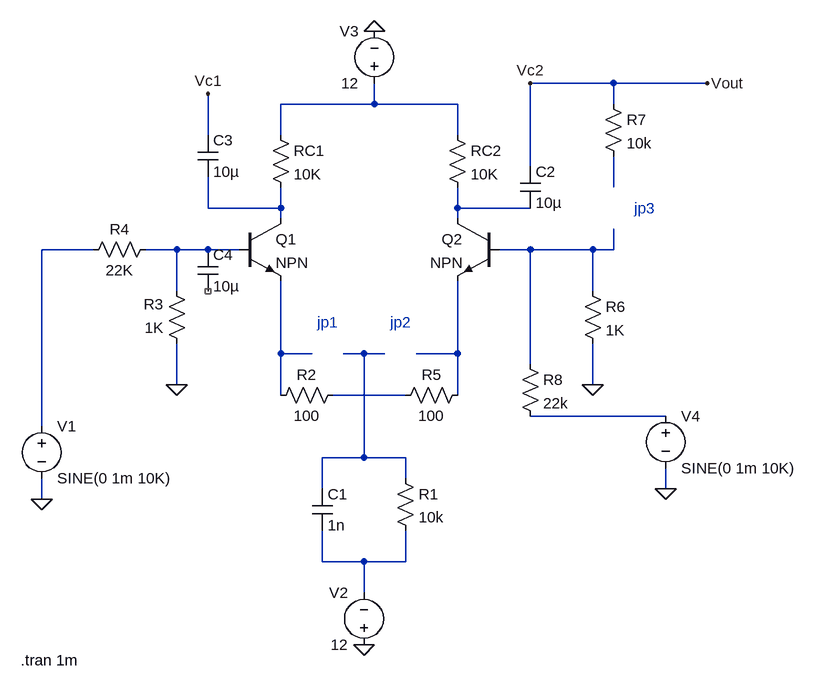
[diagram p0: schematic placa_spice.asc]
placa_spice.asc, the LTspice schematic file:
Version 4
SHEET 1 952 808
WIRE 656 -96 528 -96
WIRE 800 -96 656 -96
WIRE 288 -64 288 -96
WIRE 288 -64 144 -64
WIRE 416 -64 288 -64
WIRE 656 -64 656 -96
WIRE 32 -16 32 -80
WIRE 144 -16 144 -64
WIRE 416 -16 416 -64
WIRE 528 32 528 -96
WIRE 656 64 656 16
WIRE 32 96 32 48
WIRE 144 96 144 64
WIRE 144 96 32 96
WIRE 416 96 416 64
WIRE 528 96 416 96
WIRE 144 112 144 96
WIRE 416 112 416 96
WIRE -144 160 -224 160
WIRE -16 160 -64 160
WIRE 32 160 -16 160
WIRE 80 160 32 160
WIRE 528 160 480 160
WIRE 624 160 528 160
WIRE 656 160 656 128
WIRE 656 160 624 160
WIRE -16 224 -16 160
WIRE 624 224 624 160
WIRE 144 320 144 208
WIRE 192 320 144 320
WIRE 272 320 240 320
WIRE 304 320 272 320
WIRE 416 320 416 208
WIRE 416 320 352 320
WIRE 528 336 528 160
WIRE -16 368 -16 304
WIRE 624 368 624 304
WIRE 144 384 144 320
WIRE 336 384 224 384
WIRE 416 384 416 320
WIRE 736 416 528 416
WIRE -224 432 -224 160
WIRE 272 480 272 320
WIRE 272 480 208 480
WIRE 336 480 272 480
WIRE 336 512 336 480
WIRE 208 528 208 480
WIRE 736 528 736 496
WIRE -224 544 -224 512
WIRE 208 640 208 592
WIRE 272 640 208 640
WIRE 336 640 336 592
WIRE 336 640 272 640
WIRE 272 688 272 640
FLAG -16 368 0
FLAG -224 544 0
FLAG 272 768 0
FLAG 288 -176 0
FLAG 624 368 0
FLAG 800 -96 Vout
FLAG 32 -80 Vc1
FLAG 736 528 0
FLAG 528 -96 Vc2
SYMBOL npn 80 112 R0
SYMATTR InstName Q1
SYMBOL res 128 -32 R0
SYMATTR InstName RC1
SYMATTR Value 10K
SYMBOL res 400 -32 R0
SYMATTR InstName RC2
SYMATTR Value 10K
SYMBOL npn 480 112 M0
SYMATTR InstName Q2
SYMBOL res -48 144 R90
WINDOW 0 0 56 VBottom 2
WINDOW 3 32 56 VTop 2
SYMATTR InstName R4
SYMATTR Value 22K
SYMBOL res 0 320 R180
WINDOW 0 36 76 Left 2
WINDOW 3 36 40 Left 2
SYMATTR InstName R3
SYMATTR Value 1K
SYMBOL voltage -224 416 R0
WINDOW 123 0 0 Left 0
WINDOW 39 0 0 Left 0
SYMATTR InstName V1
SYMATTR Value SINE(0 1m 10K)
SYMBOL res 320 496 R0
SYMATTR InstName R1
SYMATTR Value 10k
SYMBOL cap 192 528 R0
SYMATTR InstName C1
SYMATTR Value 1n
SYMBOL voltage 272 784 R180
WINDOW 0 24 96 Left 2
WINDOW 3 24 16 Left 2
SYMATTR InstName V2
SYMATTR Value 12
SYMBOL res 240 368 R90
WINDOW 0 0 56 VBottom 2
WINDOW 3 32 56 VTop 2
SYMATTR InstName R2
SYMATTR Value 100
SYMBOL res 432 368 R90
WINDOW 0 0 56 VBottom 2
WINDOW 3 32 56 VTop 2
SYMATTR InstName R5
SYMATTR Value 100
SYMBOL voltage 288 -80 R180
WINDOW 0 24 96 Left 2
WINDOW 3 24 16 Left 2
SYMATTR InstName V3
SYMATTR Value 12
SYMBOL res 608 208 R0
SYMATTR InstName R6
SYMATTR Value 1K
SYMBOL res 640 -80 R0
SYMATTR InstName R7
SYMATTR Value 10k
SYMBOL cap 512 32 R0
SYMATTR InstName C2
SYMATTR Value 10µ
SYMBOL cap 16 -16 R0
SYMATTR InstName C3
SYMATTR Value 10µ
SYMBOL voltage 736 400 R0
WINDOW 123 0 0 Left 0
WINDOW 39 0 0 Left 0
SYMATTR InstName V4
SYMATTR Value SINE(0 1m 10K)
SYMBOL res 512 320 R0
SYMATTR InstName R8
SYMATTR Value 22k
SYMBOL cap 16 160 R0
SYMATTR InstName C4
SYMATTR Value 10µ
TEXT 688 96 Left 2 ;jp3
TEXT 200 272 Left 2 ;jp1
TEXT 312 272 Left 2 ;jp2
TEXT -256 792 Left 2 !.tran 1m

The netlist it stands for:
* placa_spice.asc
Q1 N003 N006 N008 0 NPN
RC1 N001 N003 10K
RC2 N001 N004 10K
Q2 N004 N007 N010 0 NPN
R4 N006 N005 22K
R3 0 N006 1K
V1 N005 0 SINE(0 1m 10K)
R1 N009 N013 10k
C1 N009 N013 1n
V2 0 N013 12
R2 N011 N008 100
R5 N010 N011 100
V3 N001 0 12
R6 N007 0 1K
R7 Vc2 N002 10k
C2 Vc2 N004 10µ
C3 Vc1 N003 10µ
V4 N012 0 SINE(0 1m 10K)
R8 N007 N012 22k
C4 N006 NC_01 10µ
.model NPN NPN
.model PNP PNP
.lib standard.bjt
* jp3
* jp1
* jp2
.tran 1m
.backanno
.end